# Altium schematic sheet FET-module.SchDoc
size A4
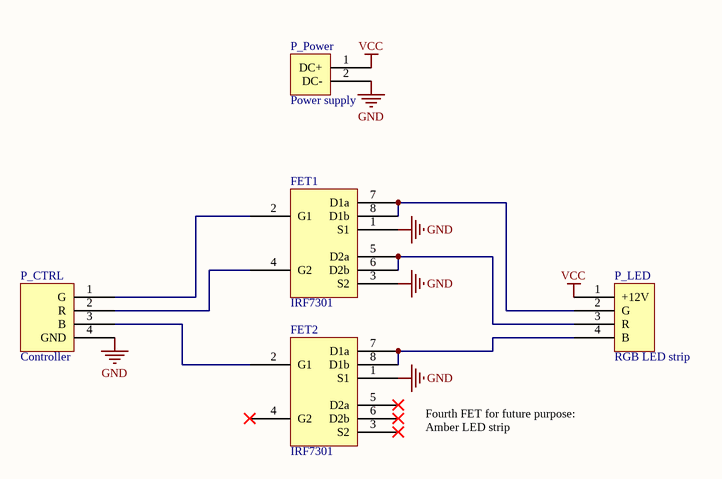
[diagram p0: FET-module.SchDoc]

## Parts
FET1  IRF7301  [SOIC8 - IRF FET]
FET2  IRF7301  [SOIC8 - IRF FET]
P_CTRL  Controller  [Controller connector]
P_LED  RGB LED strip  [LED strip RGB connector]
P_Power  Power supply  [DC connector]

## Nets
GND: FET1.1(S1) FET1.3(S2) FET2.1(S1) P_CTRL.4(GND) P_Power.2(DC-)
VCC: P_LED.1(+12V) P_Power.1(DC+)
NetFET1_2: FET1.2(G1) P_CTRL.1(G)
NetFET1_4: FET1.4(G2) P_CTRL.2(R)
NetFET1_5: FET1.5(D2a) FET1.6(D2b) P_LED.3(R)
NetFET1_7: FET1.7(D1a) FET1.8(D1b) P_LED.2(G)
NetFET2_2: FET2.2(G1) P_CTRL.3(B)
NetFET2_7: FET2.7(D1a) FET2.8(D1b) P_LED.4(B)

Not connected (* = marked no-connect by the designer): FET2 3(S2)* 4(G2)* 5(D2a)* 6(D2b)*

## Notes on the sheet
- Fourth FET for future purpose:
  Amber LED strip